# EAGLE design OMHCR (EAGLE 5.11)
VERSION: OMHCR_3_1

## Sheet 1 of 2
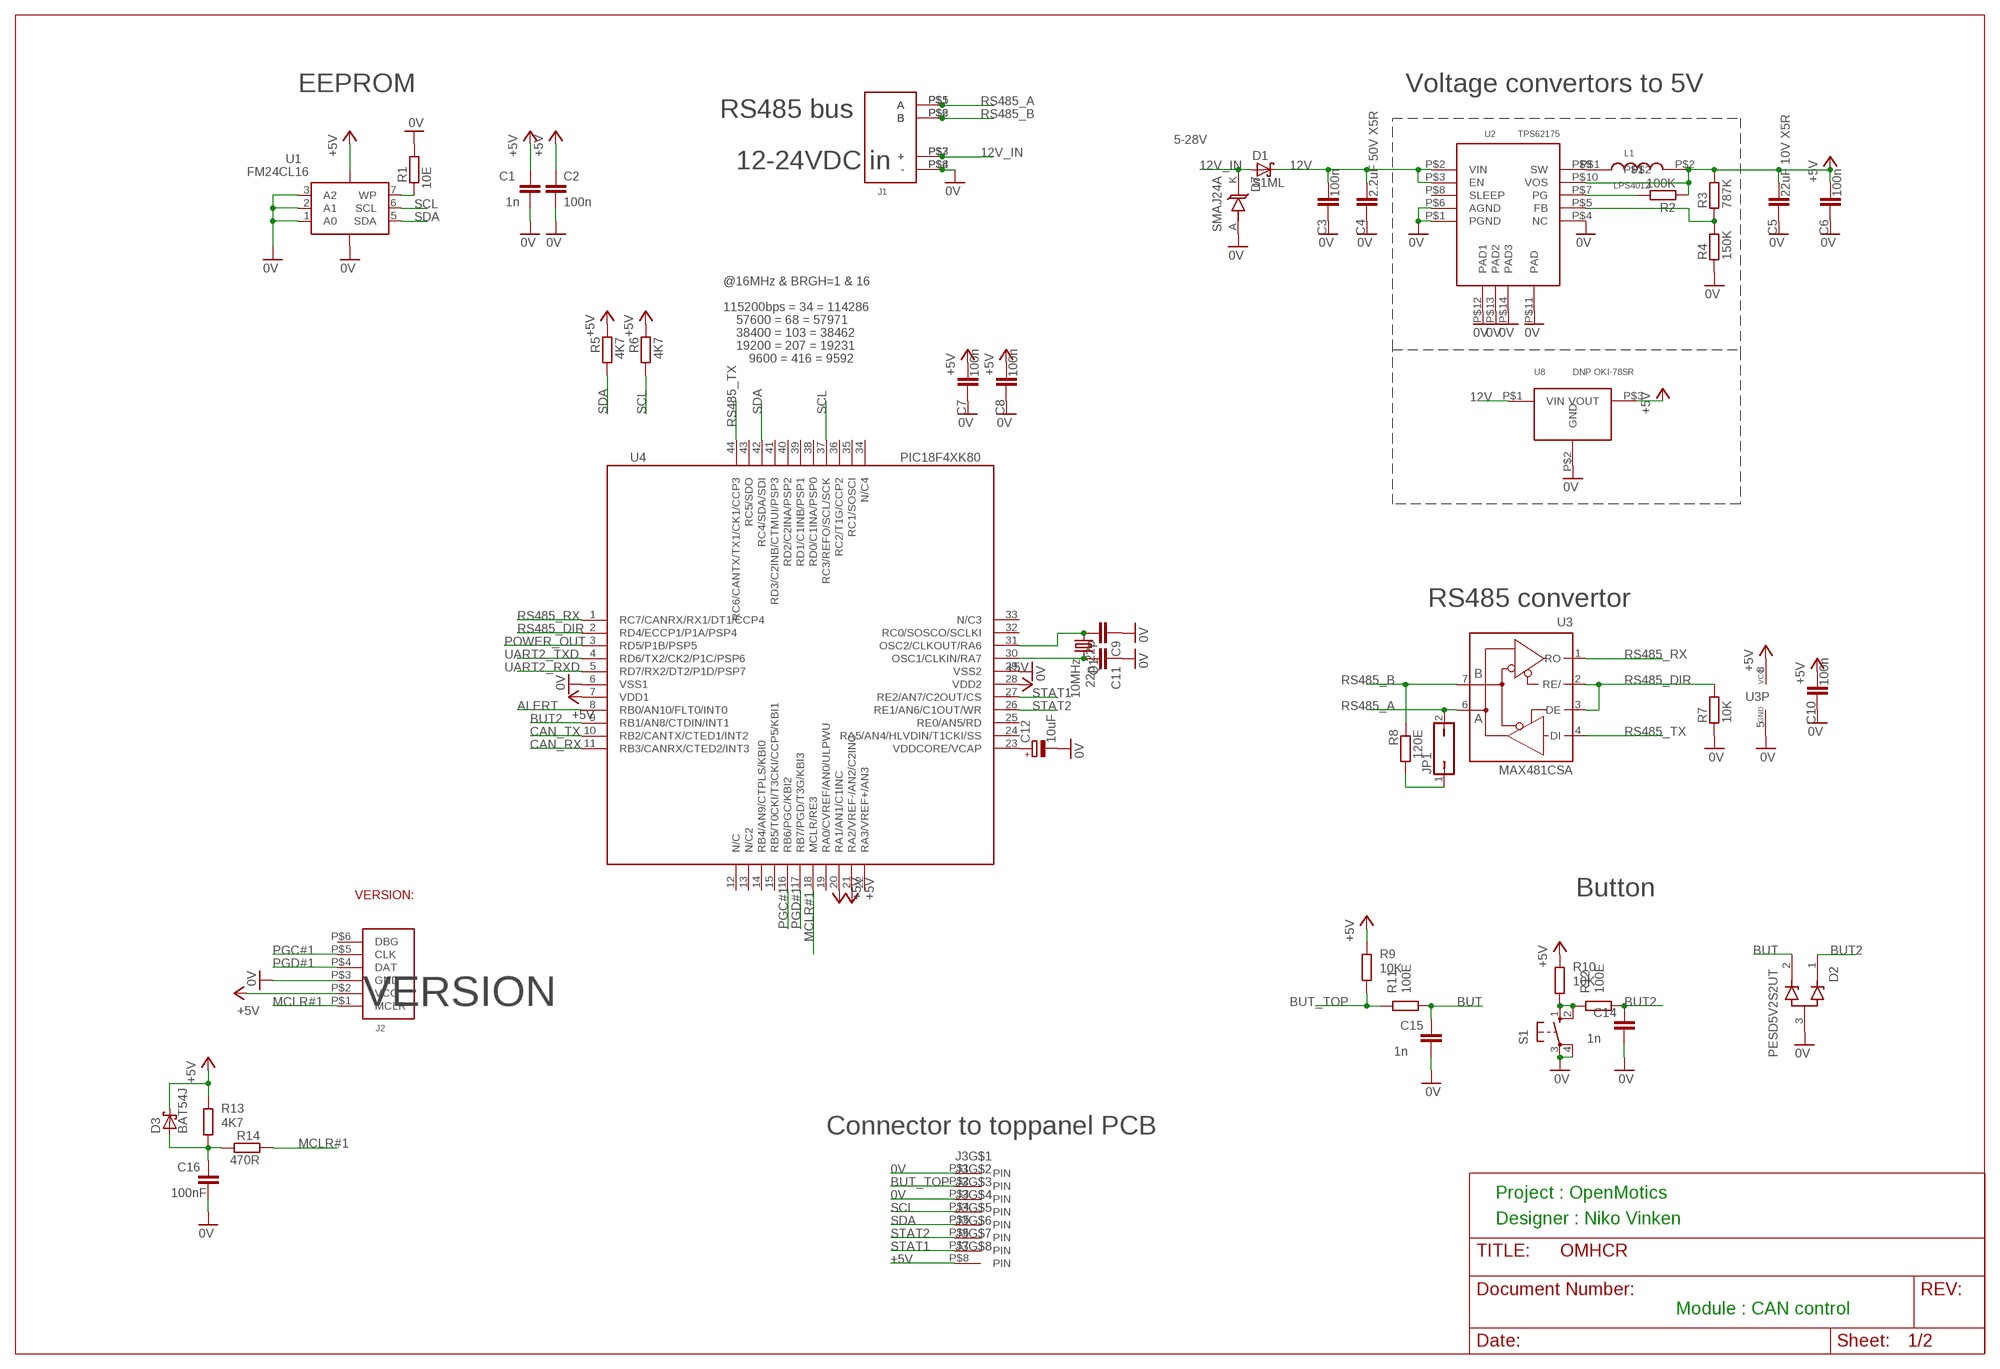
[diagram p0: schematic, sheet 1]

### Parts
C1  1n  C-EUC0603  [C0603]
C2  100n  C-EUC0603  [C0603]
C3  100n  C-EUC0603  [C0603]
C4  2.2uF 50V X5R  C-EUC1206  [C1206]
C5  22uF 10V X5R  C-EUC1206  [C1206]
C6  100n  C-EUC0603  [C0603]
C7  100n  C-EUC0603  [C0603]
C8  100n  C-EUC0603  [C0603]
C9  22p  C-EUC0603  [C0603]
C10  100n  C-EUC0603  [C0603]
C11  22p  C-EUC0603  [C0603]
C12  10uF  CPOL-EUA/3216-18W  [A/3216-18W]
C14  1n  C-EUC0603  [C0603]
C15  1n  C-EUC0603  [C0603]
C16  100nF  C-EUC0603  [C0603]
D1  S1ML  SMF5.0AT1  [SOD123FL]
D2  PESD5V2S2UT  PESD3V3S2UAT  [SOT23]
D3  BAT54J  [SOD323_REFLOW]
D7  SMAJ24A  SMAJ6.0A  [SMA]
J1  PTDA_1.5_4-PH_5.0  [PTDA_1.5_X-PH_5.0]
J2  PROG_CON  [PROG_CON_WITH_VERSION]
J3  8PIN_CON_AMP  [8PIN_CON_AMP]
JP1  JP1Q  [JP1S]
L1  LPS4012  [LPS4012_REC]
Q1  10MHz  CRYSTALSM49  [SM49]
R1  10E  R-EU_R0603  [R0603]
R2  100K  R-EU_R0603  [R0603]
R3  787K  R-EU_R0603  [R0603]
R4  150K  R-EU_R0603  [R0603]
R5  4K7  R-EU_R0603  [R0603]
R6  4K7  R-EU_R0603  [R0603]
R7  10K  R-EU_R0603  [R0603]
R8  120E  R-EU_R1206  [R1206]
R9  10K  R-EU_R0603  [R0603]
R10  10K  R-EU_R0603  [R0603]
R11  100E  R-EU_R0603  [R0603]
R12  100E  R-EU_R0603  [R0603]
R13  4K7  R-EU_R0603  [R0603]
R14  470R  R-EU_R0603  [R0603]
S1  10-XX  [B3F-10XX]
U1  FM24CL16  M24M01-RMN6P"  [SO-08]
U2  TPS62175  [QFN10]
U3  MAX481CSA  [SO08]
U4  PIC18F4XK80  [TQFP44]
U8  DNP OKI-78SR  OKI-78SR  [OKI-78SR]

### Nets
0V: C1.2 C2.2 C3.2 C4.2 C5.2 C6.2 C7.2 C8.2 C9.1 C10.2 C11.1 C12.- C14.1 C15.1 C16.1 D2.3 D7.A J1.P$4(-) J1.P$8(-) J2.P$3(GND) J3.P$1 J3.P$3 R1.2 R4.1 R7.1 S1.3(P) S1.4(P1) U1.1(A0) U1.2(A1) U1.3(A2) U1.4(VSS) U2.P$1(PGND) U2.P$4(NC) U2.P$6(AGND) U2.P$11(PAD) U2.P$12(PAD1) U2.P$13(PAD2) U2.P$14(PAD3) U3.5(GND) U4.6(VSS1) U4.29(VSS2) U8.P$2(GND) ; also sheet 2
12V: C3.1 C4.1 D1.C U2.P$2(VIN) U2.P$3(EN) U8.P$1(VIN)
12V_IN: D1.A D7.K J1.P$3(+) J1.P$7(+) ; also sheet 2
+5V: C1.1 C2.1 C5.1 C6.1 C7.1 C8.1 C10.1 D3.1 J2.P$2(VCC) J3.P$8 L1.P$2 R2.1 R3.2 R5.1 R6.1 R9.2 R10.2 R13.2 U1.8(VCC) U2.P$10(VOS) U3.8(VCC) U4.7(VDD1) U4.20(RA1/AN1/C1INC) U4.21(RA2/VREF-/AN2/C2INC) U4.28(VDD2) U8.P$3(VOUT) ; also sheet 2
ALERT: U4.8(RB0/AN10/FLT0/INT0) ; also sheet 2
BUT: C15.2 D2.2 R11.1
BUT1: R10.1 R12.2 S1.1(S) S1.2(S1)
BUT2: C14.2 D2.1 R12.1 U4.9(RB1/AN8/CTDIN/INT1)
BUT_TOP: J3.P$2 R9.1 R11.2
CAN_RX: U4.11(RB3/CANRX/CTED2/INT3) ; also sheet 2
CAN_TX: U4.10(RB2/CANTX/CTED1/INT2) ; also sheet 2
MCLR#1: J2.P$1(MCLR) R14.1 U4.18(MCLR/RE3)
N$1: JP1.1 R8.2
N$2: L1.P$1 U2.P$9(SW)
N$3: R3.1 R4.2 U2.P$5(FB)
N$4: R2.2 U2.P$7(PG)
N$9: C16.2 D3.2 R13.1 R14.2
N$32: C11.2 Q1.2 U4.30(OSC1/CLKIN/RA7)
N$33: C12.+ U4.23(VDDCORE/VCAP)
PGC#1: J2.P$5(CLK) U4.16(RB6/PGC/KBI2)
PGD#1: J2.P$4(DAT) U4.17(RB7/PGD/T3G/KBI3)
POWER_OUT: U4.3(RD5/P1B/PSP5) ; also sheet 2
RS485_A: J1.P$1(A) J1.P$5(A) JP1.2 U3.6(A)
RS485_B: J1.P$2(B) J1.P$6(B) R8.1 U3.7(B)
RS485_DIR: R7.2 U3.2(RE/) U3.3(DE) U4.2(RD4/ECCP1/P1A/PSP4)
RS485_RX: U3.1(RO) U4.1(RC7/CANRX/RX1/DT1/CCP4)
RS485_TX: U3.4(DI) U4.44(RC6/CANTX/TX1/CK1/CCP3)
SCL: J3.P$4 R6.2 U1.6(SCL) U4.37(RC3/REFO/SCL/SCK) ; also sheet 2
SDA: J3.P$5 R5.2 U1.5(SDA) U4.42(RC4/SDA/SDI) ; also sheet 2
STAT1: J3.P$7 U4.27(RE2/AN7/C2OUT/CS)
STAT2: J3.P$6 U4.26(RE1/AN6/C1OUT/WR)
UART2_RXD: U4.5(RD7/RX2/DT2/P1D/PSP7) ; also sheet 2
UART2_TXD: U4.4(RD6/TX2/CK2/P1C/PSP6) ; also sheet 2
WP1: R1.1 U1.7(WP)
Y1: C9.2 Q1.1 U4.31(OSC2/CLKOUT/RA6)
Unconnected: J2.P$6(DBG) U2.P$8(SLEEP) U4.12(N/C) U4.13(N/C2) U4.14(RB4/AN9/CTPLS/KBI0) U4.15(RB5/T0CKI/T3CKI/CCP5/KBI1) U4.19(RA0/CVREF/AN0/ULPWU) U4.22(RA3/VREF+/AN3) U4.24(RA5/AN4/HLVDIN/T1CKI/SS) U4.25(RE0/AN5/RD) U4.32(RC0/SOSCO/SCLKI) U4.33(N/C3) U4.34(N/C4) U4.35(RC1/SOSCI) U4.36(RC2/T1G/CCP2) U4.38(RD0/C1INA/PSP0) U4.39(RD1/C1INB/PSP1) U4.40(RD2/C2INA/PSP2) U4.41(RD3/C2INB/CTMUI/PSP3) U4.43(RC5/SDO)

### Notes on the sheet
- EEPROM | Voltage convertors to 5V
- RS485 bus
- 5-28V
- 12-24VDC in
- @16MHz & BRGH=1 & 16
- 115200bps = 34 = 114286
- 57600 = 68 = 57971
- 38400 = 103 = 38462
- 19200 = 207 = 19231
- 9600 = 416 = 9592
- RS485 convertor
- Button
- Connector to toppanel PCB
- Project : OpenMotics
- Designer : Niko Vinken
- Module : CAN control

## Sheet 2 of 2
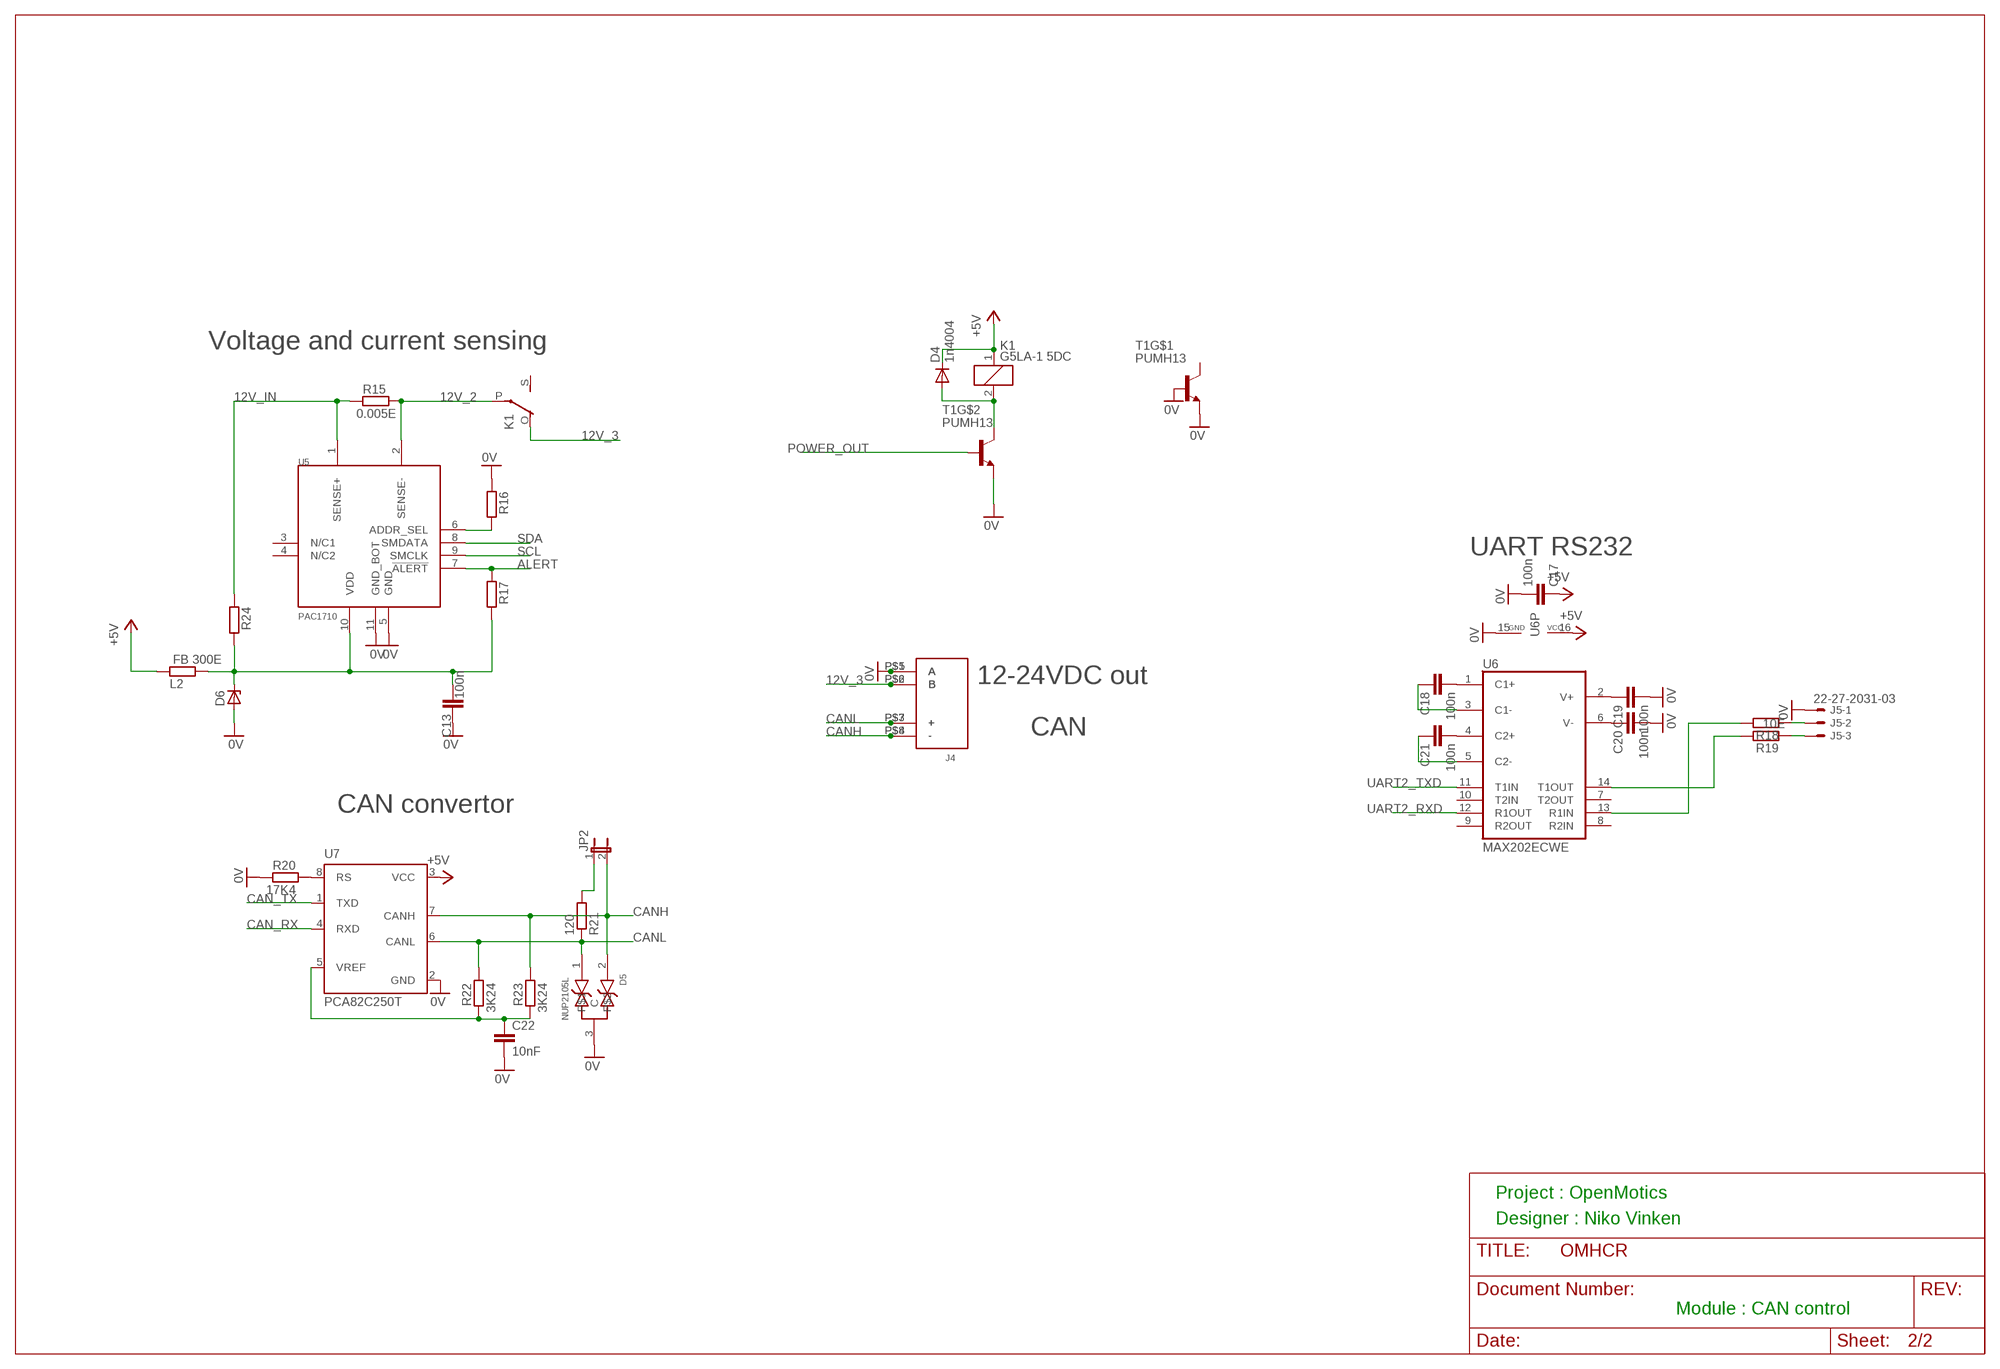
[diagram p1: schematic, sheet 2]

### Parts
C13  100n  C-EUC0603  [C0603]
C17  100n  C-EUC0603  [C0603]
C18  100n  C-EUC0603  [C0603]
C19  100n  C-EUC0603  [C0603]
C20  100n  C-EUC0603  [C0603]
C21  100n  C-EUC0603  [C0603]
C22  10nF  C-EUC0603  [C0603]
D4  1n4004  DIODE-DO41-7.6  [DO41-7.6]
D5  NUP2105L  [SOT23]
D6  ZENER-DIODESOT23  [SOT23]
J4  PTDA_1.5_4-PH_5.0  [PTDA_1.5_X-PH_5.0]
J5  22-27-2031-03  [6410-03]
JP2  JP1E  [JP1]
K1  G5LA-1 5DC  G5LE  [G5LE]
L2  FB 300E  R-EU_R0603  [R0603]
R15  0.005E  R-EU_R2512  [R2512]
R16  0E  R-EU_R0603  [R0603]
R17  4K7  R-EU_R0603  [R0603]
R18  10E  R-EU_R0603  [R0603]
R19  10E  R-EU_R0603  [R0603]
R20  17K4  R-EU_R0603  [R0603]
R21  120  R-EU_R1206  [R1206]
R22  3K24  R-EU_R0603  [R0603]
R23  3K24  R-EU_R0603  [R0603]
R24  100K  R-EU_R0603  [R0603]
T1  PUMH13  [SOT363]
U5  PAC1710  [10DFN]
U6  MAX202ECWE  [SOIC18]
U7  PCA82C250T  [SO8]

### Nets
0V: C13.2 C17.2 C19.2 C20.2 C22.2 D5.3(C) D6.1(A) J4.P$1(A) J4.P$5(A) J5.1 R16.1 R20.1 T1.1(E) T1.2(B) T1.4(E) U5.5(GND) U5.11(GND_BOT) U6.15(GND) U7.2(GND) ; also sheet 1
12V_2: K1.P(2:P) R15.2 U5.2(SENSE-)
12V_3: J4.P$2(B) J4.P$6(B) K1.O(2:O)
12V_IN: R15.1 R24.1 U5.1(SENSE+) ; also sheet 1
+5V: C17.1 D4.C K1.1 L2.1 U6.16(VCC) U7.3(VCC) ; also sheet 1
ALERT: R17.1 U5.7(!ALERT) ; also sheet 1
CAN_RX: U7.4(RXD) ; also sheet 1
CAN_TX: U7.1(TXD) ; also sheet 1
CANH: D5.2 J4.P$4(-) J4.P$8(-) JP2.2 R23.2 U7.7(CANH)
CANL: D5.1 J4.P$3(+) J4.P$7(+) R21.1 R22.2 U7.6(CANL)
N$5: R16.2 U5.6(ADDR_SEL)
N$6: C18.1 U6.3(C1-)
N$7: C20.1 U6.6(V-)
N$8: C18.2 U6.1(C1+)
N$10: D4.A K1.2 T1.3(C)
N$12: C13.1 D6.3(C) L2.2 R17.2 R24.2 U5.10(VDD)
N$16: C19.1 U6.2(V+)
N$19: J5.2 R18.1
N$20: JP2.1 R21.2
N$21: C21.2 U6.4(C2+)
N$22: R20.2 U7.8(RS)
N$23: C21.1 U6.5(C2-)
N$24: J5.3 R19.1
N$41: R18.2 U6.13(R1IN)
N$42: R19.2 U6.14(T1OUT)
N$56: C22.1 R22.1 R23.1 U7.5(VREF)
POWER_OUT: T1.5(B) ; also sheet 1
SCL: U5.9(SMCLK) ; also sheet 1
SDA: U5.8(SMDATA) ; also sheet 1
UART2_RXD: U6.12(R1OUT) ; also sheet 1
UART2_TXD: U6.11(T1IN) ; also sheet 1
Unconnected: K1.S(2:S) T1.6(C) U5.3(N/C1) U5.4(N/C2) U6.7(T2OUT) U6.8(R2IN) U6.9(R2OUT) U6.10(T2IN)

### Notes on the sheet
- Voltage and current sensing
- UART RS232
- 12-24VDC out
- CAN
- CAN convertor
- Project : OpenMotics
- Designer : Niko Vinken
- Module : CAN control

## Library data of the parts
C1-C11 C13-C22 = resistor:C-EU: CAPACITOR, European symbol
C12 = resistor:CPOL-EU: POLARIZED CAPACITOR, European symbol
D1 = diode:SMF5.0AT1: 200 W Transient Voltage Suppressor Source: Data sheet <http://www.onsemi.com/pub_link/Collateral/SMF5.0AT1-D.PDF>
D2 = OpenMotics:PESD3V3S2UAT
D3 = racktivity:BAT54J
D4 = diode:DIODE-: DIODE
D5 = OpenMotics:NUP2105L
D6 = diode:ZENER-DIODE: Z-Diode
D7 = OpenMotics:SMAJ6.0A
J1 J4 = OpenMotics:PTDA_1.5_4-PH_5.0
J2 = OpenMotics:PROG_CON
J3 = OpenMotics:8PIN_CON_AMP
J5 = con-molex:22-?-03: CONNECTOR wire to board 2.54 mm (.1 inch) pitch header; OC_FARNELL: unknown; OC_NEWARK: unknown
JP1 = jumper:JP1Q: JUMPER
JP2 = jumper:JP1E: JUMPER
K1 = relay:G5LE: RELAY 1 x switch, 10 A/120 V AC, 8 A/30 V DC, Omron; OC_FARNELL: unknown; OC_NEWARK: unknown
L1 = OpenMotics:LPS4012
L2 R2-R14 R21 = resistor:R-EU_: RESISTOR, European symbol
Q1 = crystal:CRYSTAL: CRYSTAL
R1 R15-R20 R22-R24 = rcl:R-EU_: RESISTOR, European symbol
S1 = switch-omron:10-XX: OMRON SWITCH; MPN: B3F-1000; OC_FARNELL: 176432; OC_NEWARK: 36M3542
T1 = OpenMotics:PUMH13
U1 = OpenMotics:M24M01-RMN6P
U2 = OpenMotics:TPS62175
U3 = maxim:MAX481CSA: RS485 TRANSEIVER
U4 = OpenMotics:PIC18F4XK80
U5 = OpenMotics:PAC1710
U6 = maxim:MAX202ECWE: RS232 TRANSEIVER
U7 = micro-philips:PCA82C250: CAN CONTROLLER INTERFACE; OC_FARNELL: 1085275; OC_NEWARK: unknown
U8 = OpenMotics:OKI-78SR

## Board
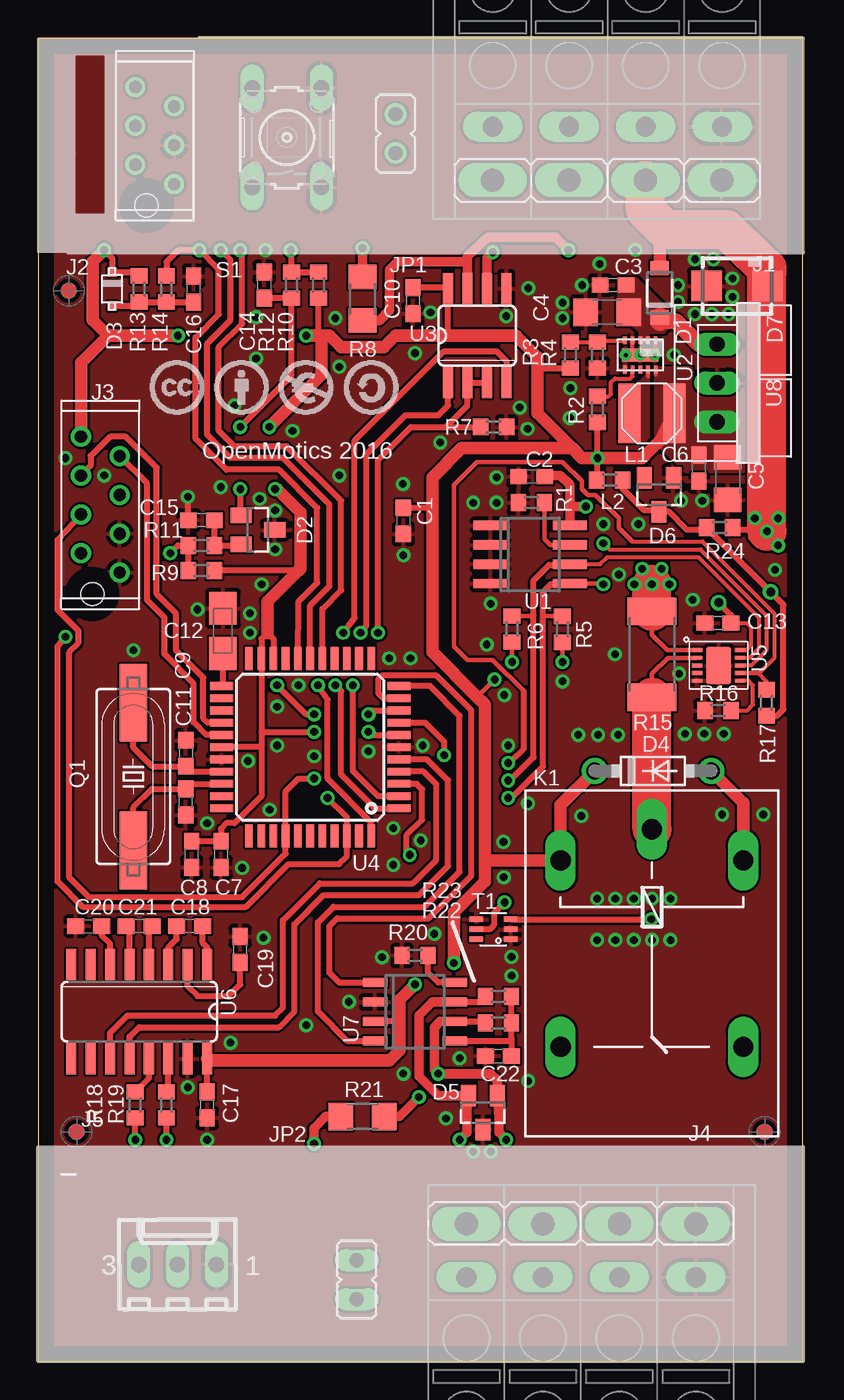
[diagram p2: board, top side]
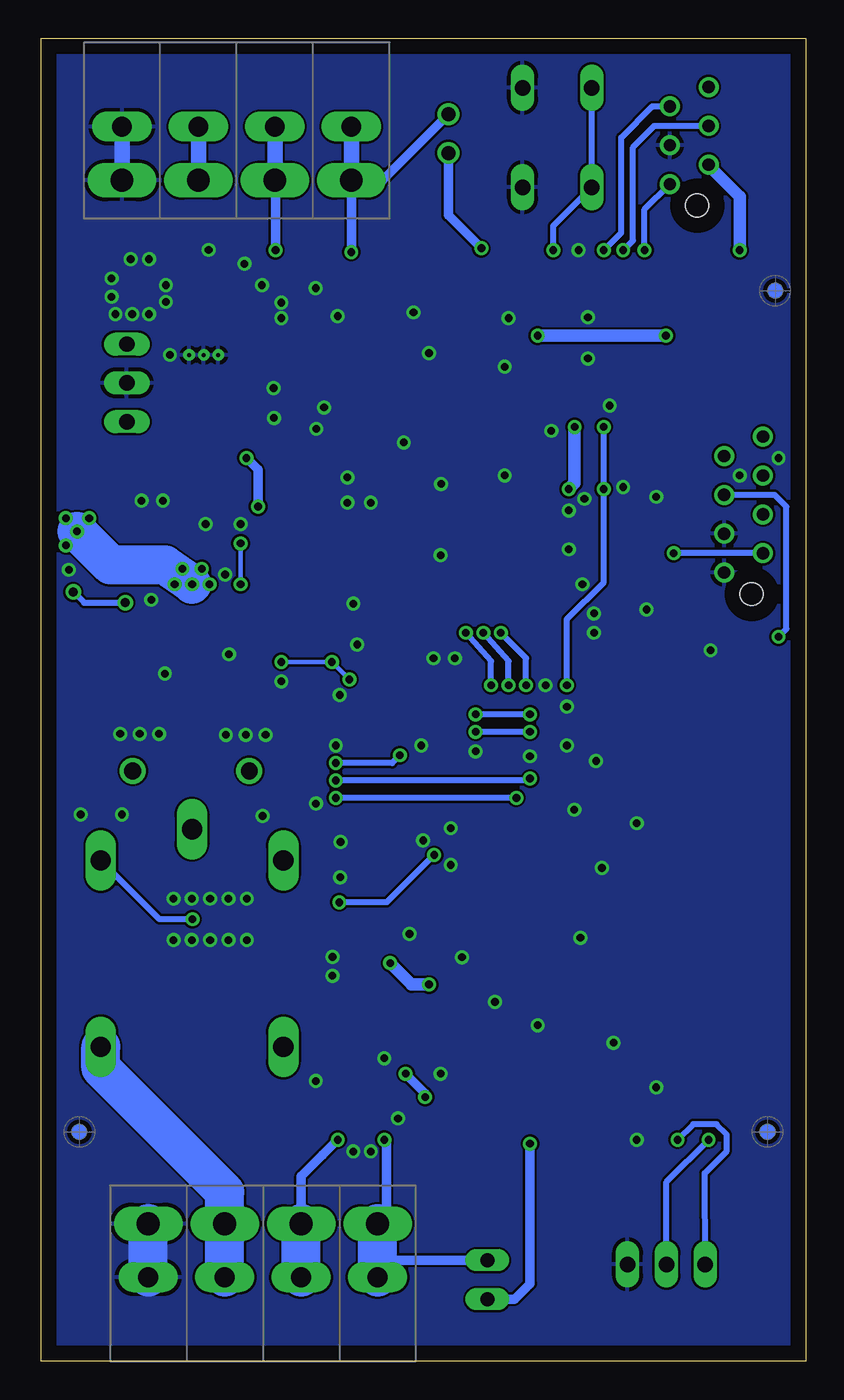
[diagram p3: board, bottom side, seen from below]

Size 50 x 86.5 mm. Coordinates in mm from the lower left corner, seen from the top.
Outline: 0,0 50,0 50,86.5 0,86.5 0,0
Copper layers (1+16): Top 0.035mm / dielectric 1.5mm / Bottom 0.035mm
Design rules "default *": minimum track width 10mil, minimum drill 24mil, track to track 6mil, track to pad 6mil, pad to pad 6mil, via to via 6mil, smd to smd 6mil, copper to edge 40mil, drill to drill 8mil, minimum pad ring 10mil, minimum via ring 8mil, stop-mask expansion 4mil, vias tented up to drill 0mil, thermal gap 10mil

### Footprints (pad centres in the part's own frame; a part is rotated, then mirrored left to right if it is on the bottom)
C0603 = smd 1.1 x 1: 1 -0.85,0; 2 0.85,0
C1206 = smd 1.6 x 1.8: 1 -1.4,0; 2 1.4,0
A/3216-18W = smd 2.15 x 1.8: + 1.475,0; - -1.475,0
SOD123FL = smd 0.91 x 1.22: A 1.625,0; C -1.625,0
SOT23 = smd 1 x 1.4: 1 -0.95,-1.1; 2 0.95,-1.1; 3 0,1.1
SOD323_REFLOW = smd 0.6 x 0.6: 1 1.1,0; 2 -1.1,0
DO41-7.6 = drill 1.1 pad 1.7 round: A 3.81,0; C -3.81,0
SMA = smd 2 x 2: A 2,0; K -2,0
PTDA_1.5_X-PH_5.0 = drill 1.5 long: P$1 0,0; P$2 5,0; P$3 10,0; P$4 15,0 | drill 1.3 long: P$5 0,3.5; P$6 5,3.5; P$7 10,3.5; P$8 15,3.5
PROG_CON_WITH_VERSION = drill 0.8 round: P$1 0,0; P$2 -2.54,1.27; P$3 0,2.54; P$4 -2.54,3.81; P$5 0,5.08; P$6 -2.54,6.35 | hole 1.5: -1.8,-1.4
8PIN_CON_AMP = drill 0.8 round: P$1 0,0; P$2 1.27,2.54; P$3 2.54,0; P$4 3.81,2.54; P$5 5.08,0; P$6 6.35,2.54; P$7 7.62,0; P$8 8.89,2.54 | hole 1.5: -1.4,1.8
6410-03 = drill 1.016 long: 1 2.54,0; 2 0,0; 3 -2.54,0
JP1S = drill 0.914 round: 1 1.27,1.27; 2 1.27,3.81
JP1 = drill 0.914 long: 1 0,-1.27; 2 0,1.27
G5LE = drill 1.321 long: 1 -7.493,-5.969; 2 -7.493,5.969; O 4.699,5.969; P -9.525,0; S 4.699,-5.969
LPS4012_REC = smd 1.45 x 3.89: P$1 -1.475,0; P$2 1.475,0
R0603 = smd 1 x 1.1: 1 -0.85,0; 2 0.85,0
SM49 = smd 5.08 x 1.778: 1 -4.826,0; 2 4.826,0
R1206 = smd 1.6 x 1.803: 1 -1.422,0; 2 1.422,0
R2512 = smd 1.8 x 3.2: 1 -2.8,0; 2 2.8,0
B3F-10XX = drill 1.016 long: 1 -3.251,2.261; 2 3.251,2.261; 3 -3.251,-2.261; 4 3.251,-2.261
SOT363 = smd 0.35 x 0.9: 1 0,0; 2 0.65,0; 3 1.3,0; 4 1.3,2.25; 5 0.65,2.25; 6 0,2.25
SO-08 = smd 0.6 x 2.2: 1 -1.905,-2.6; 2 -0.635,-2.6; 3 0.635,-2.6; 4 1.905,-2.6; 5 1.905,2.6; 6 0.635,2.6; 7 -0.635,2.6; 8 -1.905,2.6
QFN10 = smd 0.5 x 0.25: P$1 -0.95,1; P$2 -0.95,0.5; P$3 -0.95,0; P$4 -0.95,-0.5; P$5 -0.95,-1; P$6 0.95,-1; P$7 0.95,-0.5; P$8 0.95,0; P$9 0.95,0.5; P$10 0.95,1 | smd 0.84 x 2.4: P$11 0,0 | drill 0.25 round: P$12 0,0.95; P$13 0,0; P$14 0,-0.95
SO08 = smd 0.66 x 2.032: 1 -1.905,-3.073; 2 -0.635,-3.073; 3 0.635,-3.073; 4 1.905,-3.073; 5 1.905,3.073; 6 0.635,3.073; 7 -0.635,3.073; 8 -1.905,3.073
TQFP44 = smd 1.5 x 0.5: 1 -5.8,4; 2 -5.8,3.2; 3 -5.8,2.4; 4 -5.8,1.6; 5 -5.8,0.8; 6 -5.8,0; 7 -5.8,-0.8; 8 -5.8,-1.6; 9 -5.8,-2.4; 10 -5.8,-3.2; 11 -5.8,-4; 23 5.8,-4; 24 5.8,-3.2; 25 5.8,-2.4; 26 5.8,-1.6; 27 5.8,-0.8; 28 5.8,0; 29 5.8,0.8; 30 5.8,1.6; 31 5.8,2.4; 32 5.8,3.2; 33 5.8,4 | smd 0.5 x 1.5: 12 -4,-5.8; 13 -3.2,-5.8; 14 -2.4,-5.8; 15 -1.6,-5.8; 16 -0.8,-5.8; 17 0,-5.8; 18 0.8,-5.8; 19 1.6,-5.8; 20 2.4,-5.8; 21 3.2,-5.8; 22 4,-5.8; 34 4,5.8; 35 3.2,5.8; 36 2.4,5.8; 37 1.6,5.8; 38 0.8,5.8; 39 0,5.8; 40 -0.8,5.8; 41 -1.6,5.8; 42 -2.4,5.8; 43 -3.2,5.8; 44 -4,5.8
10DFN = smd 0.25 x 0.675: 1 -1,-1.41; 2 -0.5,-1.41; 3 0,-1.41; 4 0.5,-1.41; 5 1,-1.41; 6 1,1.41; 7 0.5,1.41; 8 0,1.41; 9 -0.5,1.41; 10 -1,1.41 | smd 2.38 x 1.65: 11 0,0
SOIC18 = smd 0.66 x 2.032: 1 0.635,0.737; 2 1.905,0.737; 3 3.175,0.737; 4 4.445,0.737; 5 5.715,0.737; 6 6.985,0.737; 7 8.255,0.737; 8 9.525,0.737; 9 9.525,6.883; 10 8.255,6.883; 11 6.985,6.883; 12 5.715,6.883; 13 4.445,6.883; 14 3.175,6.883; 15 1.905,6.883; 16 0.635,6.883
SO8 = smd 0.6 x 1.6: 1 -1.905,-2.6; 2 -0.635,-2.6; 3 0.635,-2.6; 4 1.905,-2.6; 5 1.905,2.6; 6 0.635,2.6; 7 -0.635,2.6; 8 -1.905,2.6
OKI-78SR = drill 1 long: P$1 0,0; P$2 2.54,0; P$3 5.08,0

### Placement (x,y rotation side)
C1  23.87,54.95 270 top
C2  32.27,57.84 180 top
C3  37.59,70.36 180 top
C4  37.21,68.58 180 top
C5  45.09,57.71 270 top
C6  43.2,58.4 270 top
C7  11.96,33.15 270 top
C8  10.03,33.15 270 top
C9  9.65,36.58 90 top
C10  24.51,69.34 270 top
C11  9.65,39.75 270 top
C12  12.08,47.75 270 top
C13  44.45,48.26 180 top
C14  14.78,70.36 270 top
C15  10.67,54.99 0 top
C16  10.16,70.1 270 top
C17  11.05,16.76 270 top
C18  9.91,28.45 0 top
C19  13.21,26.92 90 top
C20  3.3,28.45 180 top
C21  6.6,28.45 0 top
C22  30.1,19.96 180 top
D1  40.64,69.85 90 top
D2  14.37,54.36 270 top
D3  4.83,70.1 90 top
D4  40.2,38.6 0 top
D5  29.08,16.26 180 top
D6  40.59,56.65 180 top
D7  45.7,70.3 180 top
J1  29.72,77.22 0 top
J2  8.89,76.96 0 top
J3  5.33,51.56 90 top
J4  43,9 180 top
J5  9.11,6.33 0 top
JP1  22.1,77.72 0 top
JP2  20.83,5.33 0 top
K1  40.13,25.26 270 top
L1  40.13,61.98 0 top
L2  37.37,57.62 0 top
Q1  6.22,38.23 90 top
R1  32.26,56.13 180 top
R2  36.58,62.23 90 top
R3  34.8,65.79 270 top
R4  36.58,65.79 90 top
R5  34.29,47.86 90 top
R6  30.99,47.88 90 top
R7  29.78,61.09 180 top
R8  21.21,69.47 90 top
R9  10.67,51.69 0 top
R10  18.34,70.36 270 top
R11  10.67,53.34 180 top
R12  16.56,70.36 90 top
R13  6.6,70.1 90 top
R14  8.38,70.1 270 top
R15  40.13,46.23 270 top
R16  44.45,42.55 0 top
R17  47.62,43.05 270 top
R18  6.35,16.76 90 top
R19  8.38,16.76 90 top
R20  24.64,26.52 0 top
R21  21.21,16 180 top
R22  30.1,22.12 180 top
R23  30.1,23.86 180 top
R24  44.56,54.51 180 top
S1  16.26,80.01 90 top
T1  30.9,27.6 90 top
U1  32.17,52.74 270 top
U2  39.37,65.79 270 top
U3  28.7,67.06 0 top
U4  17.78,40.15 180 top
U5  44.49,45.49 270 top
U6  11.68,26.67 180 top
U7  24.64,22.86 270 top
U8  44.4,66.5 270 top
U$1  [FIDUCIAL_G10]  2.5,15 0 bottom
U$2  [FIDUCIAL_G10]  47.5,15 0 bottom
U$3  [FIDUCIAL_G10]  2.5,15 0 top
U$4  CNMB/3  [CNMB/3-]  -1.52,-1.78 0 top
U$5  [FIDUCIAL_G10]  47.5,15 0 top
U$6  [FIDUCIAL_G10]  2,70 0 top
U$7  [FIDUCIAL_G10]  2,70 0 bottom

### Tracks (layer width: path | path; a pad name or v marks a point on that pad's centre or on a via)
0V  (via drill 0.5)
  Top 0.254: U2.P$4 38.87,65.79 U2.P$11
  Top 0.406: C15.1 9.82,56.48 v9.78,56.52
  Bottom 1.016: J1.P$4 J1.P$8
  Bottom 2.54: J4.P$5 J4.P$1
  other vias: 15.49,55.63 15.49,53.09 25.65,68.58 34.8,63.63 41.58,65.8 45.4,69.6 35.56,70.36 34.29,69.22 34.29,68.2 10.41,49.15 11.94,57.15 16.64,60.83 12.83,62.48 13.84,48.9 21.59,39.88 13.72,39.24 20.32,23.5 22.48,26.42 27.56,19.81 28.45,13.72 29.59,13.72 25.91,27.94 23.88,18.8 30.96,25.2 9.78,17.91 11.05,14.48 12.57,20.83 17.53,21.97 14.73,27.69 4.32,57.91 1.78,59.05 48.19,51.74 14.61,50.8 14.48,56.39 15.62,42.8 17.02,44.2 13.84,47.62 15.62,40.26 25.15,40.26 13.34,32.26 11.05,35.18 6.22,46.48 19.68,57.91 24.64,65.91 30.61,68.33 36.7,71.75 42.8,49.78 43.56,41.02 37.72,46.23 23.22,34.85 32.03,36.46 30.73,40.26 30.48,43.56 34.29,44.45 29.34,46.86 42.04,56.26 23.88,52.7 26.29,60.07 32,60.96 31.5,62.36 29.97,57.78 29.97,56.13 28.45,56.13 29.59,49.53 36.96,54.74 39.24,54.74 43.43,56.26 41.91,44.96 42.29,41.02 44.83,41.02 19.68,65.02 19.43,68.2 14.86,72.64 37.97,51.44 30.45,31.64 32.04,18.32 26.67,15.88 40.15,30.24 41.35,30.24 38.95,30.24 37.75,30.24 36.55,30.24 36.55,27.54 37.75,27.54 38.95,27.54 40.15,27.54 41.35,27.54 30.95,26.44 23.22,32.45 25.02,34.05 30.42,33.95 35.52,35.65 44.72,35.75 47.42,35.75 37.92,40.95 36.62,40.95 35.32,40.95 22.95,45.96 24.35,45.96 23.85,57.36 34.78,61.67 41.85,70.36 44.15,72.06 39.05,72.66 32.05,70.16 14.25,65.56 14.25,68.26 15.13,36.06 18.04,39.56 42.95,72.06 41.85,69.26 42.95,68.46 44.05,68.46 45.15,68.46 45.4,70.8
  pour Top (rank 3): -3.94,-4.32 53.34,-4.32 53.34,89.41 -3.94,89.41
  pour Bottom (rank 3): -3.43,-4.45 53.85,-4.45 53.85,89.28 -3.43,89.28
12V
  Top 1.016: 40.64,68 41.7,68 43.2,66.5 U8.P$1
  Top 1.27: D1.C 40.64,68
  pour Top (no thermals): 39.88,66.8 39.88,67.18 40.01,67.31 40.89,67.31 41.15,67.56 41.15,68.71 39.12,70.74 37.97,70.74 37.97,67.94 38.73,67.94 39.37,67.31 39.37,66.67 39.88,66.67
12V_2
  Top 0.305: U5.2 41.17,45.99 40.13,44.96 R15.2
  Top 2.54: K1.P R15.2
12V_3
  Bottom 2.54: J4.P$6 J4.P$2 38,11.08 46.1,19.18 K1.O
12V_IN  (via drill 0.5)
  Top 0.254: D7.K 47.65,70.35 47.65,71.2
  Top 0.305: U5.1 41.14,46.49 40.13,47.5 R15.1
  Top 0.406: 40.77,51.31 v40.77,51.82 | 40.77,51.31 v41.27,50.8 | 39.5,51.31 v39.5,51.82 | 39.5,51.31 v38.99,50.8 | v48.39,53.34 46.61,53.85 v46.86,55.12 v47.65,54.26 | v47.65,54.26 v48.39,55.12 | 40.77,51.31 v40.13,50.8 39.5,51.31 | R24.1 45.59,54.36 47.5,54.36 47.53,54.38 v47.65,54.26
  Top 0.813: D1.A 40.64,74.52 40.48,74.52
  Top 2.54: R15.1 v40.13,50.8 | v47.65,54.26 47.65,71.2 47.65,71.47 45,74 41,74 40.48,74.52 39.72,75.28 J1.P$3
  Bottom 1.016: J1.P$3 J1.P$7
  Bottom 2.54: v40.13,50.8 41.91,52.07 45.47,52.07 v47.65,54.26
+5V  (via drill 0.5)
  Top 0.254: U2.P$10 40.37,64.53 arc90 40.39,64.52
  Top 0.305: v34.29,45.72 R5.1 | 28.7,43.43 v29.84,44.58 | v30.99,45.72 R6.1
  Top 0.406: U4.28 14.49,40.15 14.61,40.13 | 14.61,41.15 14.61,40.13 | 14.61,45.92 14.61,41.15 | 14.61,45.92 U4.21 | 23.52,40.89 U4.7 21.79,40.95 v21.59,41.15 | R13.2 arc90 6.35,71.2 D3.1 4.83,72.14 v4.32,72.64 | R2.1 v36.58,59.05 36.52,59 L2.1 | R10.2 18.34,67.26 18.54,67.06 | 26.8,67.12 26.86,67.12 26.92,67.06 | 26.8,67.12 26.8,67.06 | 26.8,67.12 U3.8 26.73,70.19 C10.1 | R3.2 32.8,64.94 32.64,64.77 | 17.02,51.69 R9.2 | U4.20 15.38,47.23 14.99,47.62 14.61,47.24 14.61,45.92 | C17.1 U6.16 | 23.62,22.23 U7.3 | 14.61,41.15 v18.03,41.15 | C8.1 C7.1 11.96,34.81 12.32,35.18 12.83,35.18 14.61,36.96 14.61,40.13 | 33.2,57.91 C2.1 | 39.24,58.93 39.24,59.05 39.62,58.93 39.62,59.18 | C1.1 25.74,55.8 25.78,55.75
  Top 0.61: 34.77,55.88 U1.8 | 34.77,55.88 34.77,57.31 34.16,57.91 33.2,57.91 | v35.81,55.88 34.77,55.88
  Top 0.813: L1.P$2 40.77,60.33 39.62,59.18 39.5,59.05 v36.58,59.05 35.56,59.05 34.92,59.69 | 34.92,59.69 32.64,61.98 32.64,64.77 32.64,65.66 31.24,67.06 26.92,67.06 23.37,67.06 22.61,66.29 19.81,66.29 19.05,67.06 18.54,67.06 | v9.14,67.06 4.57,67.06 | 4.57,67.06 3.56,68.07 3.56,71.88 v4.32,72.64 | 18.54,67.06 18.54,64.52 v15.11,61.09 | v15.49,57.02 15.62,57.02 17.14,55.5 17.14,51.82 17.02,51.69 14.99,49.66 14.99,47.62 | J3.P$8 2.79,65.28 4.57,67.06 | U6.16 11.15,19.68 22.99,19.68 23.62,20.32 23.62,22.23 23.62,23.62 v24.64,24.64 | v27.18,26.04 27.18,29.34 29.21,31.37 29.21,32.7 | 34.92,59.69 27.69,59.69 25.78,57.78 25.78,55.75 25.78,46.35 28.7,43.43 29.21,42.93 29.21,32.7 | 18.54,67.06 v17.53,67.06 | D4.C 34.16,36.37 K1.1 29.26,32.75 29.21,32.7
  Bottom 0.305: v34.29,45.72 v30.99,45.72 v29.84,44.58
  Bottom 0.406: v18.03,41.15 v21.59,41.15
  Bottom 0.61: v36.58,59.05 35.81,58.29 v35.81,55.88
  Bottom 0.813: v17.53,67.06 v9.14,67.06 | v4.32,72.64 4.3,72.7 4.3,76.13 6.35,78.18 J2.P$2 | v15.49,57.02 15.11,57.4 v15.11,61.09 | v24.64,24.64 25.78,24.64 v27.18,26.04
  pour Top (no thermals): 40.39,64.9 40.39,60.45 40.64,60.2 40.63,59.9 42.39,58.16 45.9,58.2 46.1,58.2 46.1,64.4 44.09,64.4 43.99,64.39 42.72,64.32 42.72,64.89 41.78,64.89 40.89,64.9
ALERT  (via drill 0.5)
  Top 0.254: R17.1 47.62,44.45 47.08,44.99 U5.7 47.15,44.99 48.13,45.97 48.13,48.9 43.43,53.59 38.86,53.59
  Top 0.305: 38.86,53.59 37.97,54.48 37.97,55.12 36.45,56.64 35.94,56.64 35.56,57.02 35.56,57.53 34.29,58.8 28.7,58.8 27.18,57.28 27.18,46.74 28.07,45.85 29.72,45.85 31.75,43.81
  Top 0.406: U4.8 25.31,41.75 26.54,40.51 v26.54,39.62 | v30.73,39.12 30.82,39.12 30.9,39.2 31.75,40.03 31.75,43.81
  Bottom 0.406: v26.54,39.62 27.05,39.12 v30.73,39.12
BUT
  Top 0.406: D2.2 arc-90 13.2,53.34 R11.1 C15.2
BUT1  (via drill 0.5)
  Top 0.406: v16.51,72.64 16.56,72.72 R12.2 R10.1
  Bottom 0.406: v16.51,72.64 16.51,74.24 S1.1 S1.2
BUT2  (via drill 0.5)
  Top 0.406: v13.21,61.09 16.56,64.44 R12.1 C14.2 | v13.21,57.02 13.21,55.37 D2.1 | U4.9 21.85,42.55 v21.59,42.29 | v18.03,42.29 17.53,42.29 v15.62,44.2
  Bottom 0.406: v13.21,61.09 v13.21,57.02 13.21,50.93 15.62,48.51 v15.62,44.2 | v18.03,42.29 v21.59,42.29
BUT_TOP  (via drill 0.5)
  Top 0.406: v8.64,52.83 9.14,53.34 R11.2 R9.1
  Bottom 0.406: J3.P$2 v8.64,52.83
CAN_RX
  Top 0.406: U7.4 20.19,20.95 18.29,22.86 18.29,28.7 19.3,29.72 25.27,29.72 27.56,32 27.56,42.2 25.61,44.15 U4.11
CAN_TX
  Top 0.406: U7.1 19.68,24.77 19.05,25.4 19.05,28.45 19.56,28.96 25.53,28.96 28.32,31.75 28.32,42.56 26.05,44.83 22.48,44.83 22.23,44.58 22.23,43.69 22.56,43.35 U4.10
CANH  (via drill 0.5)
  Top 0.406: R23.2 28.89,23.5 U7.7
  Top 0.61: U7.7 25.78,23.5 24.89,22.61 24.89,18.64 26.18,17.36 D5.2 28.1,17.3 28.03,17.23 28.03,14.95 v27.56,14.48
  Bottom 0.61: JP2.2 28,6.6 | J4.P$4 28,9.02 27.4,9.02 27.4,14.3 v27.56,14.48
  Bottom 1.27: 28,6.6 J4.P$8
  Bottom 2.54: J4.P$8 J4.P$4
CANL  (via drill 0.5)
  Top 0.406: R22.2 29.14,22.23 U7.6
  Top 0.61: U7.6 26.29,22.23 25.91,21.84 25.91,19.05 v26.16,18.8 29.59,18.8 30.03,18.35 D5.1 30.04,17.36 30.1,17.3 30.13,14.95 v30.6,14.48 | R21.1 23.62,16 v24.89,17.27
  Bottom 0.61: v24.89,17.27 24.89,17.53 v26.16,18.8 | J4.P$3 33,12.1 31.6,13.48 v30.6,14.48
  Bottom 2.54: J4.P$7 J4.P$3
MCLR#1  (via drill 0.5)
  Top 0.406: U4.18 17.02,49.66 18.25,50.89 18.25,55.79 15.75,58.29 12.32,58.29 10.29,60.33 10.29,66.93 11.81,68.45 11.81,71.37 v10.54,72.64 9.14,72.64 8.38,71.88 R14.1
  Bottom 0.406: v10.54,72.64 10.54,75.31 J2.P$1
N$1  (via drill 0.5)
  Top 0.61: R8.2 v21.21,72.77
  Bottom 0.61: JP1.1 23.37,74.93 v21.21,72.77
N$2
  Top 0.254: U2.P$9 39.87,64.4 arc90 39.88,64.39
  pour Top (no thermals): 39.88,64.52 39.88,60.45 39.62,60.2 38.1,60.2 38.1,63.75 39.12,63.75
N$3
  Top 0.254: U2.P$5 36.68,66.74 arc90 R4.2 R3.1
N$4
  Top 0.254: U2.P$7 38.87,64.4 38.73,64.26 37.72,64.26 37.47,64.01 37.47,63.25 37.3,63.08 R2.2
N$5
  Top 0.254: U5.6 46.44,44.49 46.74,44.2 46.74,42.93 46.35,42.55 R16.2
N$6
  Top 0.406: U6.3 8.51,27.05 9.06,27.6 C18.1
N$7
  Top 0.406: U6.6 4.7,27.3 4.15,27.85 C20.1
N$8
  Top 0.406: U6.1 11.05,27.05 10.76,27.34 C18.2
N$9
  Top 0.406: C16.2 R14.2 R13.1 6.35,69 D3.2
N$10  (via drill 0.5)
  Top 0.406: T1.3 v40.1,28.9
  Top 0.813: K1.2 46.1,36.51 D4.A
  Bottom 0.406: v40.1,28.9 42.25,28.9 K1.2
N$12  (via drill 0.6)
  Top 0.254: U5.10 46.29,46.49 46.6,46.8 46.6,48 46.34,48.26 C13.1
  Top 0.406: R17.2 48.3,42.2 48.73,42.63 48.73,49.47 v47.9,50.3 43.83,54.37 R24.2 43.81,54.36 42.42,54.36 41.22,55.55 D6.3 40.52,55.63 39.62,55.63 38.22,57.03 L2.2 | v44.5,49.6 45.3,48.8 C13.1
  Bottom 0.406: v47.9,50.3 47.2,49.6 v44.5,49.6
N$16
  Top 0.406: U6.2 9.78,24.51 10.41,23.88 12.45,23.88 13.21,24.64 C19.1
N$19  (via drill 0.5)
  Top 0.406: v6.35,14.48 R18.1
  Bottom 0.406: v6.35,14.48 9.11,11.72 J5.2
N$20  (via drill 0.5)
  Top 0.61: v18.03,14.22 18.03,15.24 18.8,16 R21.2
  Bottom 0.61: JP2.1 19.05,4.06 18.03,5.08 v18.03,14.22
N$21
  Top 0.406: U6.4 7.24,28.45 C21.2
N$22
  Top 0.406: U7.8 26.16,24.77 25.49,25.44 R20.2
N$23
  Top 0.406: U6.5 5.97,28.45 C21.1
N$24  (via drill 0.5)
  Top 0.406: v8.38,14.48 R19.1
  Bottom 0.406: v8.38,14.48 7.37,15.49 5.84,15.49 5.17,14.82 5.17,13.73 6.6,12.3 J5.3
N$32
  Top 0.305: C11.2 10.13,38.55
  Top 0.406: 10.13,38.55 U4.30 | C11.2 7.45,38.9 6.22,40.13 Q1.2
N$33
  Top 0.406: C12.+ 12.08,44.25 U4.23
N$41
  Top 0.406: R18.2 7.24,18.5 U6.13
N$42
  Top 0.406: R19.2 8.51,17.74 U6.14
N$56
  Top 0.406: R23.1 R22.1 30.95,21.08 | 30.95,21.08 C22.1 | U7.5 30.82,20.95 arc90 30.95,21.08
PGC#1  (via drill 0.5)
  Top 0.406: U4.16 18.58,49.19 19.81,50.42 19.81,56.26 16.26,59.82 12.83,59.82 11.81,60.83 11.81,66.29 13.34,67.82 13.34,72.52 v13.21,72.64
  Bottom 0.406: v13.21,72.64 12.06,73.79 12.06,80.01 10.03,82.04 J2.P$5
PGD#1  (via drill 0.5)
  Top 0.406: U4.17 17.78,49.4 19.05,50.67 19.05,56.01 16,59.05 12.57,59.05 11.05,60.58 11.05,66.55 12.57,68.07 12.57,72.01 v11.94,72.64
  Bottom 0.406: v11.94,72.64 11.3,73.28 11.3,79.38 9.91,80.77 J2.P$4
POWER_OUT  (via drill 0.5)
  Top 0.406: T1.5 29.55,28.25 29.8,28.5 29.8,29.3 v30.5,30 | v24.3,33.1 24.1,33.4 24.1,34.4 25.1,35.4 25.1,37.4 24.75,37.75 U4.3
  Bottom 0.406: v30.5,30 27.4,30 v24.3,33.1
RS485_A  (via drill 0.5)
  Top 0.61: U3.6 29.34,72.14 v29.72,72.52
  Bottom 0.61: v29.72,72.52 J1.P$1 27.69,77.22 JP1.2
  Bottom 1.016: J1.P$1 J1.P$5
RS485_B  (via drill 0.5)
  Top 0.61: 28.07,72.01 U3.7 | 28.07,72.01 28.07,72.26 29.41,73.51 33.81,73.51 v34.67,72.64 | R8.1 22.33,68.05 22.99,68.71 22.99,71.37 23.5,71.88 27.94,71.88 28.07,72.01
  Bottom 0.61: v34.67,72.64 34.67,77.17 J1.P$2
  Bottom 1.016: J1.P$2 J1.P$6
RS485_DIR  (via drill 0.5)
  Top 0.406: U4.2 22.23,36.95 20.57,38.61 v20.57,44.2 | v22.23,47.62 22.23,58.93 24.38,61.09 26.67,61.09 | 26.67,61.09 28.07,62.48 U3.2 U3.3 | 29.06,61.09 R7.2 26.67,61.09
  Bottom 0.406: v20.57,44.2 20.57,45.77 v22.23,47.62
RS485_RX  (via drill 0.5)
  Top 0.406: U4.1 22.02,36.15 19.81,38.35 19.81,43.81 v19.43,44.2 | v21.08,47.62 21.46,48.11 21.46,59.31 24,61.85 26.16,61.85 26.8,62.48 U3.1
  Bottom 0.406: v19.43,44.2 19.43,45.77 v21.08,47.62
RS485_TX  (via drill 0.5)
  Top 0.406: U4.44 21.78,35.24 18.92,38.1 18.92,43.26 v18.29,44.2 | v19.94,47.62 20.7,48.59 20.7,60.2 26.54,66.04 29.97,66.04 30.61,65.41 U3.4
  Bottom 0.406: v18.29,44.2 18.29,45.97 v19.94,47.62
SCL  (via drill 0.5)
  Top 0.254: U5.9 46.5,45.99 47.12,46.61 47.12,48.64 43.18,52.58 37.21,52.58 36.74,52.11 U1.6
  Top 0.305: R6.2 32.35,48.73 32.38,48.77
  Top 0.406: J3.P$4 1.27,53.72 1.27,49.12 2.64,47.75 2.64,46.96 2.03,46.35 2.03,31.62 3.3,30.35 13.34,30.35 16.18,33.2 U4.37 16.18,37.26 17.02,38.1 v18.03,38.1 | v30.73,37.97 30.86,37.97 32.38,39.5 32.38,48.77 32.38,51.05 33.4,52.07 34.73,52.07 U1.6
  Bottom 0.406: v18.03,38.1 18.16,37.97 v30.73,37.97
SDA  (via drill 0.5)
  Top 0.254: U5.8 46.63,45.49 47.62,46.48 47.62,48.77 43.31,53.09 37.34,53.09 v36.96,53.47
  Top 0.305: R5.2 33.09,48.71 33.02,48.64 | v36.96,50.8 36.92,50.84 U1.5
  Top 0.406: v1.78,47.37 1.27,46.74 1.27,31.37 2.92,29.72 13.59,29.72 16.38,32.51 19.68,32.51 20.18,33.01 U4.42 20.18,35.57 v18.92,36.83 | v30.73,36.83 30.87,36.83 30.9,36.8 33,38.9 33,39 33.02,38.92 33.02,48.64 33.02,50.29 33.53,50.8 34.73,50.8 U1.5
  Bottom 0.305: v36.96,50.8 v36.96,53.47
  Bottom 0.406: J3.P$5 2.03,56.64 1.27,55.88 1.27,47.88 v1.78,47.37 | v18.92,36.83 v30.73,36.83
STAT1
  Top 0.406: U4.27 10.99,40.95 10.16,41.78 10.16,44.32 8.26,46.23 8.26,48.64 7.11,49.78 7.11,57.4 J3.P$7
STAT2
  Top 0.406: U4.26 11.08,41.75 10.79,42.04 10.79,44.7 9.02,46.48 9.02,48.9 7.75,50.16 7.75,58.42 5.71,60.45 4.7,60.45 3.43,59.18 3.43,58.55 J3.P$6
UART2_RXD
  Top 0.406: U6.12 5.97,21.21 6.6,21.84 15.75,21.84 16.76,22.86 16.76,28.57 18.67,30.48 24.89,30.48 26.8,32.38 26.8,37.97 25.42,39.35 U4.5
UART2_TXD
  Top 0.406: U6.11 4.7,21.46 5.84,22.61 15.49,22.61 16,23.11 16,28.83 18.41,31.24 24.51,31.24 26.04,32.77 26.04,37.72 25.2,38.55 U4.4
WP1
  Top 0.305: R1.1 33.11,53.76 33.49,53.38 U1.7
Y1
  Top 0.305: C9.2 10.1,37.75
  Top 0.406: 10.1,37.75 U4.31 | C9.2 7.45,37.43 6.22,36.2 Q1.1

### Text on the board
tNames: OpenMotics 2016